# EAGLE design basic (EAGLE 9.6.1)
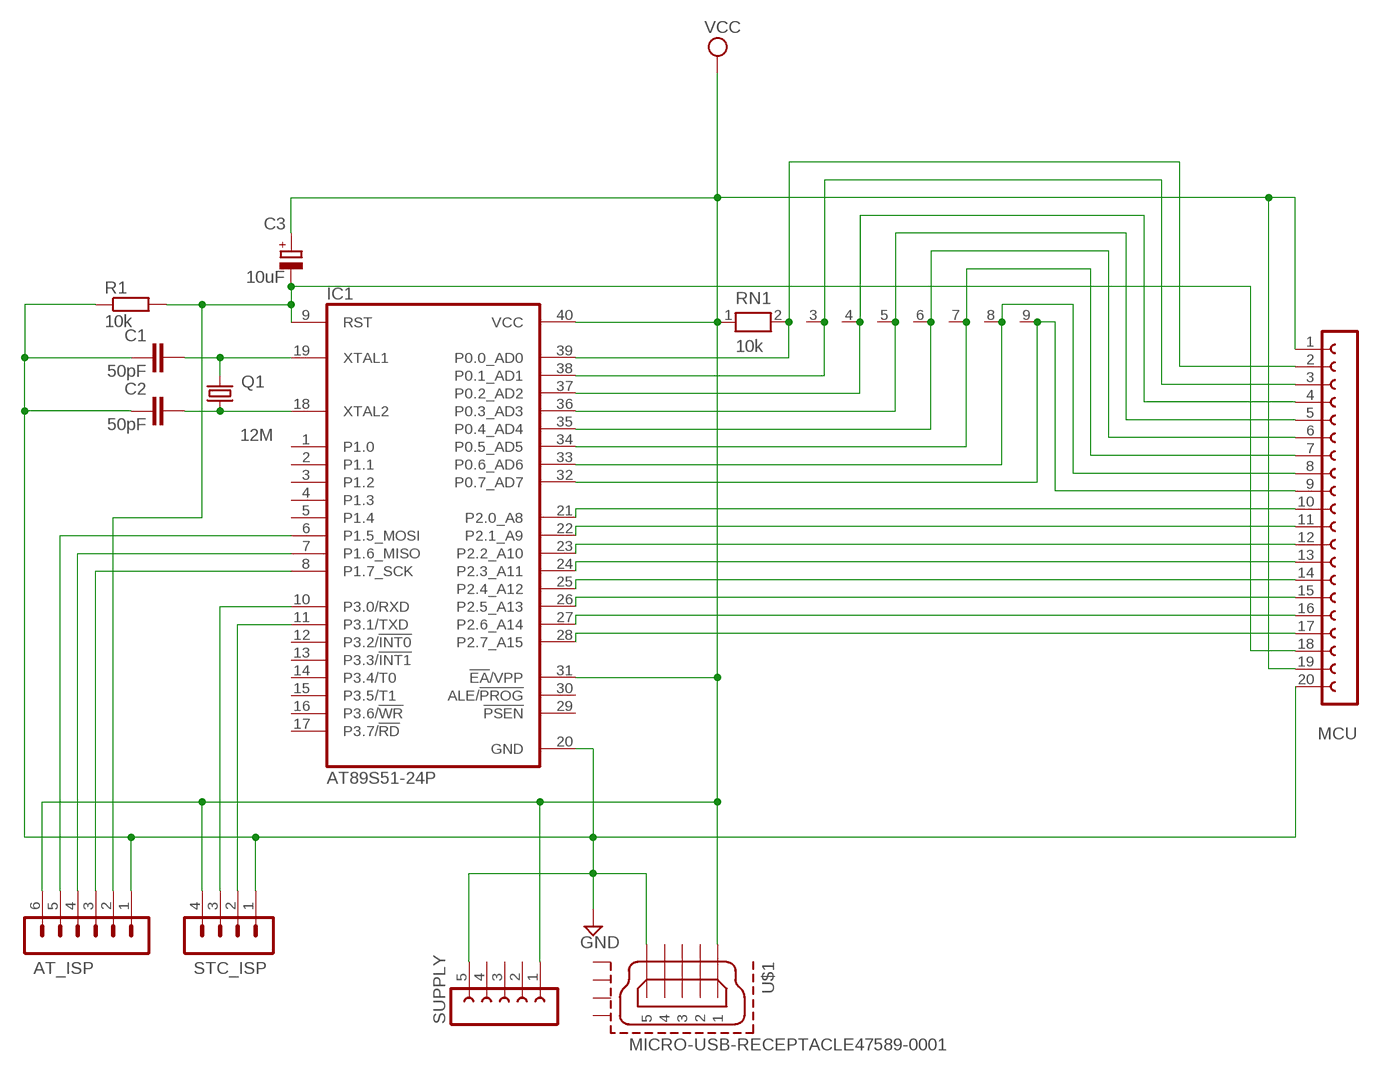
[diagram p0: schematic, sheet 1]

## Parts
AT_ISP  MA06-1  [MA06-1]
C1  50pF  C-EU050-025X075  [C050-025X075]
C2  50pF  C-EU050-025X075  [C050-025X075]
C3  10uF  CPOL-EUE2.5-6  [E2,5-6]
IC1  AT89S51-24P  [DIL40]
MCU  FE20-1  [FE20]
Q1  12M  CRYSTALHC49U70  [HC49U70]
R1  10k  R-EU_0207/10  [0207/10]
RN1  10k  RN08  [RN-9]
STC_ISP  MA04-1  [MA04-1]
SUPPLY  FE05-1  [FE05-1]
U$1  MICRO-USB-RECEPTACLE47589-0001  [47589-0001]

## Nets
GND: AT_ISP.1 C1.1 C2.1 IC1.20(GND) MCU.20 R1.1 STC_ISP.1 SUPPLY.5 U$1.5
N$2: IC1.28(P2.7_A15) MCU.17
N$3: C1.2 IC1.19(XTAL1) Q1.2
N$4: C2.2 IC1.18(XTAL2) Q1.1
N$5: AT_ISP.2 C3.- IC1.9(RST) MCU.18 R1.2
N$6: IC1.27(P2.6_A14) MCU.16
N$7: IC1.38(P0.1_AD1) MCU.3 RN1.3
N$8: IC1.26(P2.5_A13) MCU.15
N$9: IC1.25(P2.4_A12) MCU.14
N$10: IC1.36(P0.3_AD3) MCU.5 RN1.5
N$11: IC1.35(P0.4_AD4) MCU.6 RN1.6
N$12: IC1.34(P0.5_AD5) MCU.7 RN1.7
N$13: IC1.33(P0.6_AD6) MCU.8 RN1.8
N$14: IC1.32(P0.7_AD7) MCU.9 RN1.9
N$15: IC1.24(P2.3_A11) MCU.13
N$16: IC1.23(P2.2_A10) MCU.12
N$17: IC1.22(P2.1_A9) MCU.11
N$18: IC1.10(P3.0/RXD) STC_ISP.3
N$19: IC1.21(P2.0_A8) MCU.10
N$22: IC1.37(P0.2_AD2) MCU.4 RN1.4
N$26: IC1.39(P0.0_AD0) MCU.2 RN1.2
N$49: AT_ISP.3 IC1.8(P1.7_SCK)
N$50: AT_ISP.4 IC1.7(P1.6_MISO)
N$51: AT_ISP.5 IC1.6(P1.5_MOSI)
N$52: IC1.11(P3.1/TXD) STC_ISP.2
VCC: AT_ISP.6 C3.+ IC1.31(!EA!/VPP) IC1.40(VCC) MCU.1 MCU.19 RN1.1 STC_ISP.4 SUPPLY.1 U$1.1
Unconnected: IC1.1(P1.0) IC1.2(P1.1) IC1.3(P1.2) IC1.4(P1.3) IC1.5(P1.4) IC1.12(P3.2/!INT0) IC1.13(P3.3/!INT1) IC1.14(P3.4/T0) IC1.15(P3.5/T1) IC1.16(P3.6/!WR) IC1.17(P3.7/!RD) IC1.29(!PSEN) IC1.30(ALE/!PROG) SUPPLY.2 SUPPLY.3 SUPPLY.4 U$1.2 U$1.3 U$1.4 U$1.CASING1(GND1) U$1.CASING2(GND2) U$1.CASING3(GND3) U$1.CASING4(GND4)

## Library data of the parts
AT_ISP = con-lstb:MA06-1: PIN HEADER; OC_FARNELL: unknown; OC_NEWARK: unknown
C1 C2 = rcl:C-EU: CAPACITOR, European symbol; SPICEPREFIX: C
C3 = rcl:CPOL-EU: POLARIZED CAPACITOR, European symbol; SPICEPREFIX: C
IC1 = atmel:AT89S51-*: 8-bit Microcontroller with 4K BytesIn-System Programmable Flash Source: http://www.atmel.com/dyn/resources/prod_documents/doc2487.pdf; MPN: AT89S51-24PU; OC_FARNELL: 1095739; OC_NEWARK: 96K6578
MCU = con-lsta:FE20-1: FEMALE HEADER; OC_FARNELL: unknown; OC_NEWARK: unknown
Q1 = crystal:CRYSTAL: CRYSTAL; OC_FARNELL: unknown; OC_NEWARK: unknown
R1 = rcl:R-EU_: RESISTOR, European symbol; SPICEPREFIX: R
RN1 = resistor-net:RN08: RESISTOR NETWORK; OC_FARNELL: unknown; OC_NEWARK: unknown
STC_ISP = con-lstb:MA04-1: PIN HEADER; OC_FARNELL: unknown; OC_NEWARK: unknown
SUPPLY = con-lsta:FE05-1: FEMALE HEADER; OC_FARNELL: unknown; OC_NEWARK: unknown
U$1 = con-molex-usb:MICRO-USB-RECEPTACLE: MICRO USB RECEPTACLES Micro-USB Receptacles, SMT, Lead-Free from MOLEX <http://www.molex.com/>. (C) 2014 Tomasz Boleslaw CEDRO, cederom@tlen.pl, http://www.tomek.cedro.info. Version 0.1 (2014-01-17): Initial release. Version 0.2 (2014-02-06): Updated 47589-0001 footprint pins/pads/milling. Following devices are included: 1. 47589-0001 Micro-USB AB Receptacle, Bottom Mount, SMT, Lead-Free <http://www.molex.com/molex/products/datasheet.jsp?part=active/0475890001_IO_CONNECTORS.xml> (Technical Drawing <http://www.molex.com/pdm_docs/sd/475890001_sd.pdf>).

## Board
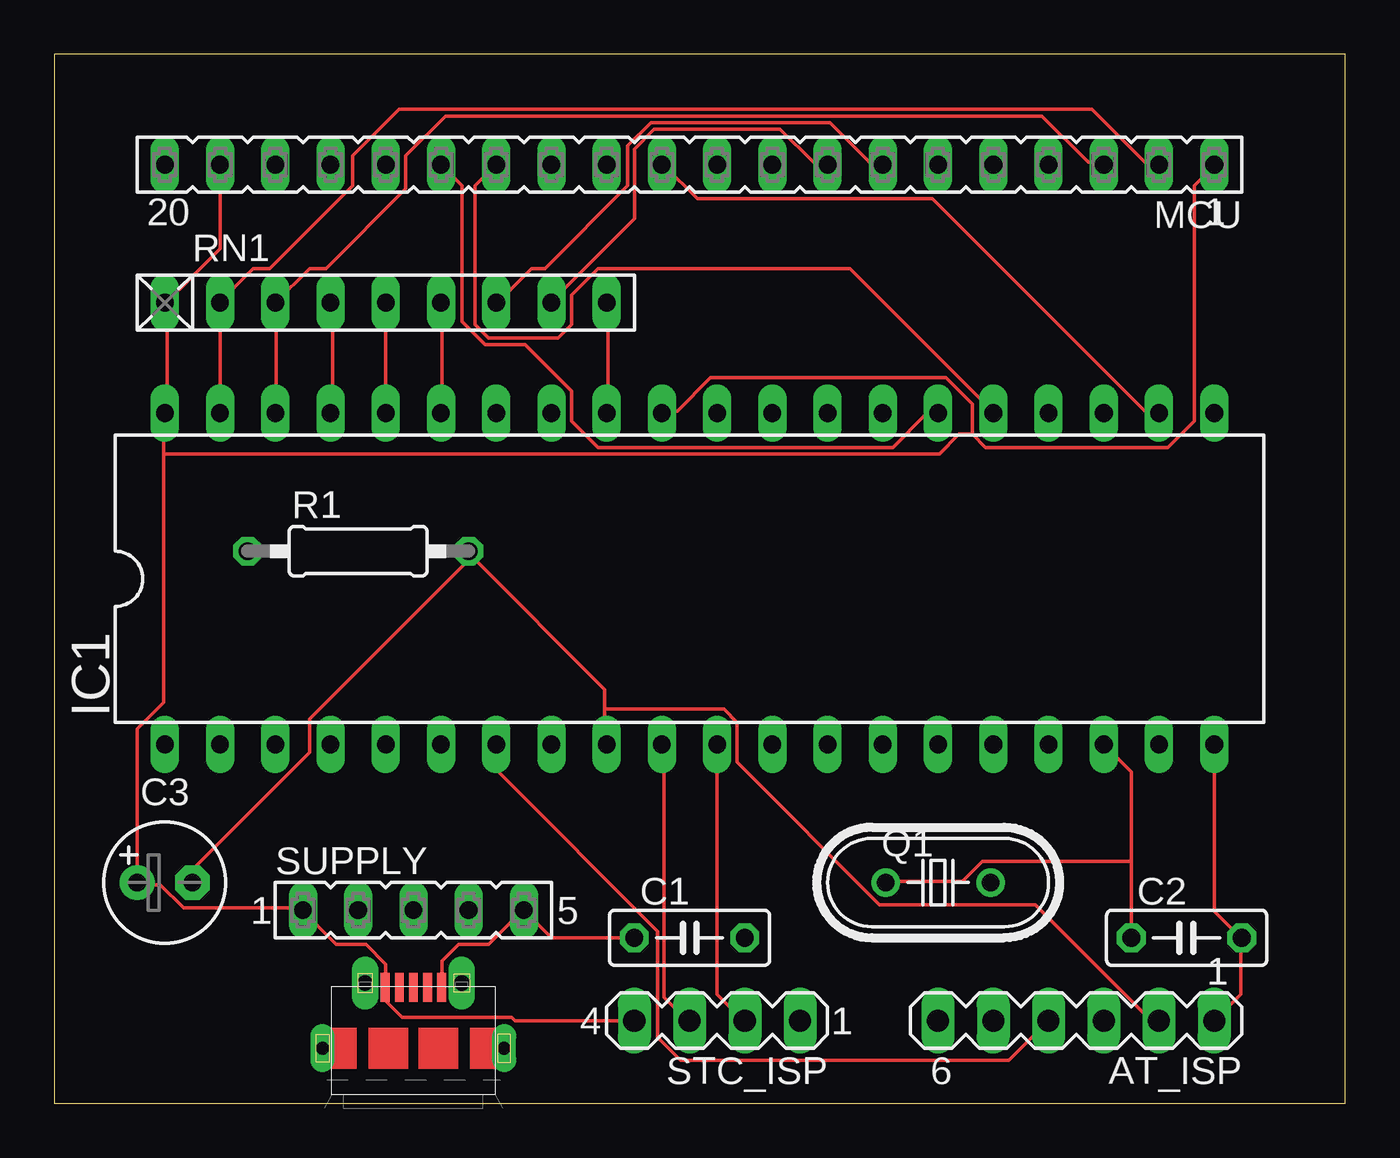
[diagram p1: board, top side]
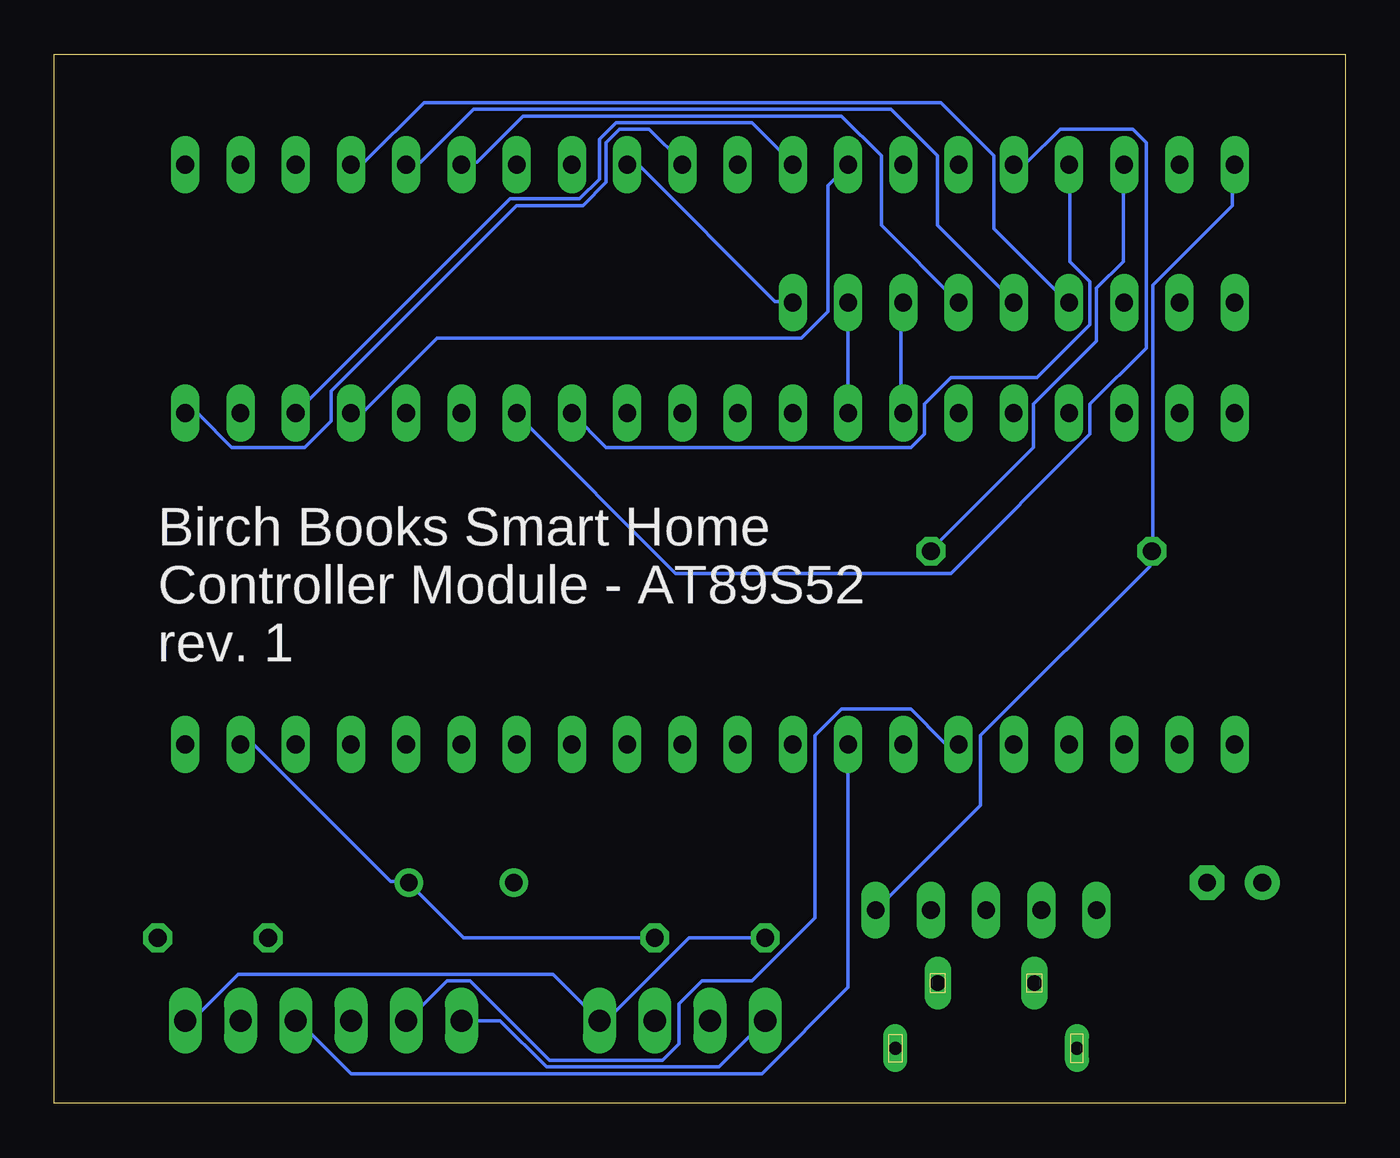
[diagram p2: board, bottom side, seen from below]

Size 59.36 x 48.25 mm. Coordinates in mm from the lower left corner, seen from the top.
Outline: 0,0 59.36,0 59.36,48.25 0,48.25 0,0
Copper layers (1*16): Top 0.035mm / dielectric 1.5mm / Bottom 0.035mm
Design rules "default": minimum track width 6mil, minimum drill 0.35mm, track to track 6mil, track to pad 6mil, pad to pad 6mil, via to via 6mil, smd to smd 6mil, copper to edge 40mil, drill to drill 6mil, minimum pad ring 10mil, minimum via ring 8mil, stop-mask expansion 4mil, vias tented up to drill 0mil, thermal gap 10mil

### Footprints (pad centres in the part's own frame; a part is rotated, then mirrored left to right if it is on the bottom)
MA06-1 = drill 1.016 long: 1 -6.35,0; 2 -3.81,0; 3 -1.27,0; 4 1.27,0; 5 3.81,0; 6 6.35,0
C050-025X075 = drill 0.813 octagon: 1 -2.54,0; 2 2.54,0
E2,5-6 = drill 0.813 pad 1.6: + -1.27,0 | drill 0.813 pad 1.6 octagon: - 1.27,0
DIL40 = drill 0.813 long: 1 -24.13,-7.62; 2 -21.59,-7.62; 3 -19.05,-7.62; 4 -16.51,-7.62; 5 -13.97,-7.62; 6 -11.43,-7.62; 7 -8.89,-7.62; 8 -6.35,-7.62; 9 -3.81,-7.62; 10 -1.27,-7.62; 11 1.27,-7.62; 12 3.81,-7.62; 13 6.35,-7.62; 14 8.89,-7.62; 15 11.43,-7.62; 16 13.97,-7.62; 17 16.51,-7.62; 18 19.05,-7.62; 19 21.59,-7.62; 20 24.13,-7.62; 21 24.13,7.62; 22 21.59,7.62; 23 19.05,7.62; 24 16.51,7.62; 25 13.97,7.62; 26 11.43,7.62; 27 8.89,7.62; 28 6.35,7.62; 29 3.81,7.62; 30 1.27,7.62; 31 -1.27,7.62; 32 -3.81,7.62; 33 -6.35,7.62; 34 -8.89,7.62; 35 -11.43,7.62; 36 -13.97,7.62; 37 -16.51,7.62; 38 -19.05,7.62; 39 -21.59,7.62; 40 -24.13,7.62
FE20 = drill 0.813 long: 1 -24.13,0; 2 -21.59,0; 3 -19.05,0; 4 -16.51,0; 5 -13.97,0; 6 -11.43,0; 7 -8.89,0; 8 -6.35,0; 9 -3.81,0; 10 -1.27,0; 11 1.27,0; 12 3.81,0; 13 6.35,0; 14 8.89,0; 15 11.43,0; 16 13.97,0; 17 16.51,0; 18 19.05,0; 19 21.59,0; 20 24.13,0
HC49U70 = drill 0.813: 1 -2.413,0; 2 2.413,0
0207/10 = drill 0.813 octagon: 1 -5.08,0; 2 5.08,0
RN-9 = drill 0.813 long: 1 -10.16,0; 2 -7.62,0; 3 -5.08,0; 4 -2.54,0; 5 0,0; 6 2.54,0; 7 5.08,0; 8 7.62,0; 9 10.16,0
MA04-1 = drill 1.016 long: 1 -3.81,0; 2 -1.27,0; 3 1.27,0; 4 3.81,0
FE05-1 = drill 0.813 long: 1 -5.08,0; 2 -2.54,0; 3 0,0; 4 2.54,0; 5 5.08,0
47589-0001 = smd 1.35 x 0.4: 1 2.8,1.3; 2 2.8,0.65; 3 2.8,0; 4 2.8,-0.65; 5 2.8,-1.3 | drill 0.6 pad 0.95 long: CASING1 0,4.175; CASING2 0,-4.175 | drill 0.7 pad 1.1 long: CASING3 3,2.225; CASING4 3,-2.225

### Placement (x,y rotation side)
AT_ISP  46.99,3.81 180 top
C1  29.21,7.62 0 top
C2  52.07,7.62 180 top
C3  5.08,10.16 0 top
IC1  29.21,24.13 0 top
MCU  29.21,43.18 180 top
Q1  40.64,10.16 0 top
R1  13.97,25.4 0 top
RN1  15.24,36.83 0 top
STC_ISP  30.48,3.81 180 top
SUPPLY  16.51,8.89 0 top
U$1  16.51,2.54 90 top

### Tracks (layer width: path | path; a pad name or v marks a point on that pad's centre or on a via)
GND
  Top 0.152: 54.56,7.62 54.56,5.03 AT_ISP.1 | IC1.20 53.34,8.84 54.56,7.62 | 54.56,7.62 C2.1 | U$1.5 17.83,5.49 17.83,6.55 18.59,7.32 19.96,7.32 21.49,8.84 SUPPLY.5 22.86,7.62 C1.1
  Bottom 0.152: MCU.20 5.18,43.13 5.18,41.3 8.84,37.64 8.84,25.45 R1.1 8.99,25.3 8.99,24.69 16.76,16.92 16.76,13.72 SUPPLY.5 | C1.1 30.18,7.62 33.98,3.81 STC_ISP.1 36.42,5.94 50.9,5.94 53.03,3.81 AT_ISP.1
N$2
  Bottom 0.152: IC1.28 33.98,30.18 19.96,30.18 19.36,30.79 19.36,32.16 18.14,33.38 14.17,33.38 11.73,35.81 11.73,37.8 12.65,38.71 12.65,43.13 MCU.17
N$3
  Bottom 0.152: C1.2 40.54,7.62 42.98,10.06 Q1.2 43.13,10.21 43.89,10.21 50.14,16.46 50.75,16.46 IC1.19
N$4
  Top 0.152: 49.53,11.12 49.53,15.24 IC1.18 | 49.53,11.12 C2.2 | 49.53,11.12 42.67,11.12 41.76,10.21 38.25,10.21 Q1.1
N$5
  Top 0.152: 25.3,18.14 25.3,19.05 19.2,25.15 | 25.3,18.14 25.3,16.61 IC1.9 | 19.2,25.15 19.05,25.3 R1.2 19.2,25.15 | AT_ISP.2 50.44,3.81 45.11,9.14 37.95,9.14 31.39,15.7 31.39,17.53 30.79,18.14 25.3,18.14 | 19.2,25.15 11.73,17.68 11.73,16.15 6.4,10.82 6.4,10.21 C3.-
  Bottom 0.152: MCU.18 10.21,43.13 10.21,38.71 11.43,37.49 11.43,35.05 14.33,32.16 14.33,30.18 19.05,25.45 R1.2
N$6
  Bottom 0.152: MCU.16 15.24,43.28 14.63,43.28 13.11,44.81 9.75,44.81 9.14,44.2 9.14,34.75 11.73,32.16 11.73,30.79 18.14,24.38 30.79,24.38 38.1,31.7 IC1.27
N$7
  Top 0.152: IC1.38 10.21,31.85 10.21,36.73 RN1.3 11.73,38.41 12.5,38.41 16.15,42.06 16.15,43.59 17.98,45.41 45.41,45.41 47.55,43.28 48.16,43.28 MCU.3
N$8
  Top 0.152: MCU.15 18.75,42.22 18.75,35.97 19.81,34.9 21.64,34.9 23.77,32.77 23.77,31.39 24.99,30.18 38.56,30.18 40.08,31.7 40.54,31.7 IC1.26
N$9
  Top 0.152: MCU.14 19.36,42.22 19.36,35.81 19.96,35.2 23.16,35.2 23.77,35.81 23.77,37.19 24.99,38.41 36.58,38.41 43.13,31.85 IC1.25
N$10
  Top 0.152: RN1.5 IC1.36
  Bottom 0.152: MCU.5 43.13,43.28 42.52,43.28 40.08,45.72 20.88,45.72 18.75,43.59 18.75,40.39 15.24,36.88 RN1.5
N$11
  Top 0.152: IC1.35 17.83,31.85 17.83,36.73 RN1.6
  Bottom 0.152: RN1.6 21.34,40.39 21.34,43.59 23.16,45.41 37.8,45.41 39.93,43.28 40.54,43.28 MCU.6
N$12
  Top 0.152: MCU.7 38.1,43.28 37.49,43.28 35.66,45.11 27.43,45.11 26.36,44.04 26.36,42.22 22.55,38.41 21.95,38.41 20.42,36.88 RN1.7
  Bottom 0.152: IC1.34 20.42,31.85 20.42,36.73 RN1.7
N$13
  Top 0.152: MCU.8 35.51,43.28 34.9,43.28 33.38,44.81 27.58,44.81 26.67,43.89 26.67,40.69 22.86,36.88 RN1.8
  Bottom 0.152: RN1.8 IC1.33
N$14
  Top 0.152: IC1.32 25.45,31.85 25.45,36.73 RN1.9
  Bottom 0.152: MCU.9 32.92,43.13 32.46,43.13 26.21,36.88 25.45,36.88 RN1.9
N$15
  Bottom 0.152: IC1.24 45.72,31.85 45.11,31.85 41.76,35.2 24.99,35.2 23.77,36.42 23.77,42.22 22.86,43.13 MCU.13
N$16
  Bottom 0.152: IC1.23 38.41,41.6 35.2,41.6 34.29,42.52 34.29,44.35 33.53,45.11 27.28,45.11 25.45,43.28 MCU.12
N$17
  Top 0.152: IC1.22 50.75,31.85 50.14,31.85 40.39,41.6 29.57,41.6 28.04,43.13 MCU.11
N$18
  Top 0.152: IC1.10 28.04,16.46 28.04,4.88 29.11,3.81 STC_ISP.3
N$19
  Bottom 0.152: IC1.21 53.34,31.7 52.73,31.7 51.21,30.18 47.85,30.18 46.63,31.39 46.63,32.77 38.1,41.3 35.05,41.3 33.98,42.37 33.98,44.2 33.38,44.81 32,44.81 30.48,43.28 MCU.10
N$22
  Top 0.152: IC1.37 12.8,31.85 12.8,36.73 RN1.4
  Bottom 0.152: MCU.4 45.72,43.28 45.11,43.28 42.37,46.02 18.59,46.02 16.15,43.59 16.15,40.23 12.8,36.88 RN1.4
N$26
  Top 0.152: IC1.39 RN1.2 7.62,36.88 9.14,38.41 9.91,38.41 13.72,42.22 13.72,43.59 15.85,45.72 47.7,45.72 50.14,43.28 50.75,43.28 MCU.2
N$49
  Bottom 0.152: IC1.8 22.86,5.33 26.82,1.37 45.72,1.37 48.16,3.81 AT_ISP.3
N$50
  Top 0.152: AT_ISP.4 43.89,1.98 28.8,1.98 27.74,3.05 27.74,7.92 20.42,15.24 20.42,16.46 IC1.7
N$51
  Bottom 0.152: IC1.6 17.83,16.61 18.44,16.61 19.96,18.14 23.16,18.14 24.38,16.92 24.38,8.53 27.28,5.64 29.57,5.64 30.63,4.57 30.63,2.74 31.39,1.98 36.58,1.98 40.23,5.64 41.3,5.64 43.13,3.81 AT_ISP.5
N$52
  Top 0.152: IC1.11 30.48,5.03 31.7,3.81 STC_ISP.2
VCC
  Top 0.152: 42.22,30.79 42.22,32.16 41,33.38 30.18,33.38 28.65,31.85 28.04,31.85 IC1.31 | 42.22,30.79 42.82,30.18 51.21,30.18 52.43,31.39 52.43,42.22 53.34,43.13 MCU.1 | MCU.19 7.62,39.32 5.18,36.88 RN1.1 5.18,36.73 5.18,31.85 IC1.40 5.03,31.7 5.03,29.87 | STC_ISP.4 21.18,3.81 21.03,3.96 16,3.96 15.24,4.72 15.24,5.33 U$1.1 15.24,5.49 15.24,6.4 14.33,7.32 12.95,7.32 11.43,8.84 SUPPLY.1 11.43,8.99 5.94,8.99 4.88,10.06 3.81,10.06 C3.+ 3.81,17.22 5.03,18.44 5.03,29.87 | 42.22,30.79 41.6,30.79 40.69,29.87 5.03,29.87
  Bottom 0.152: AT_ISP.6 38.86,3.81 36.73,1.68 28.8,1.68 STC_ISP.4

### Text on the board
bNames: Birch Books Smart Home / Controller Module - AT89S52 / rev. 1